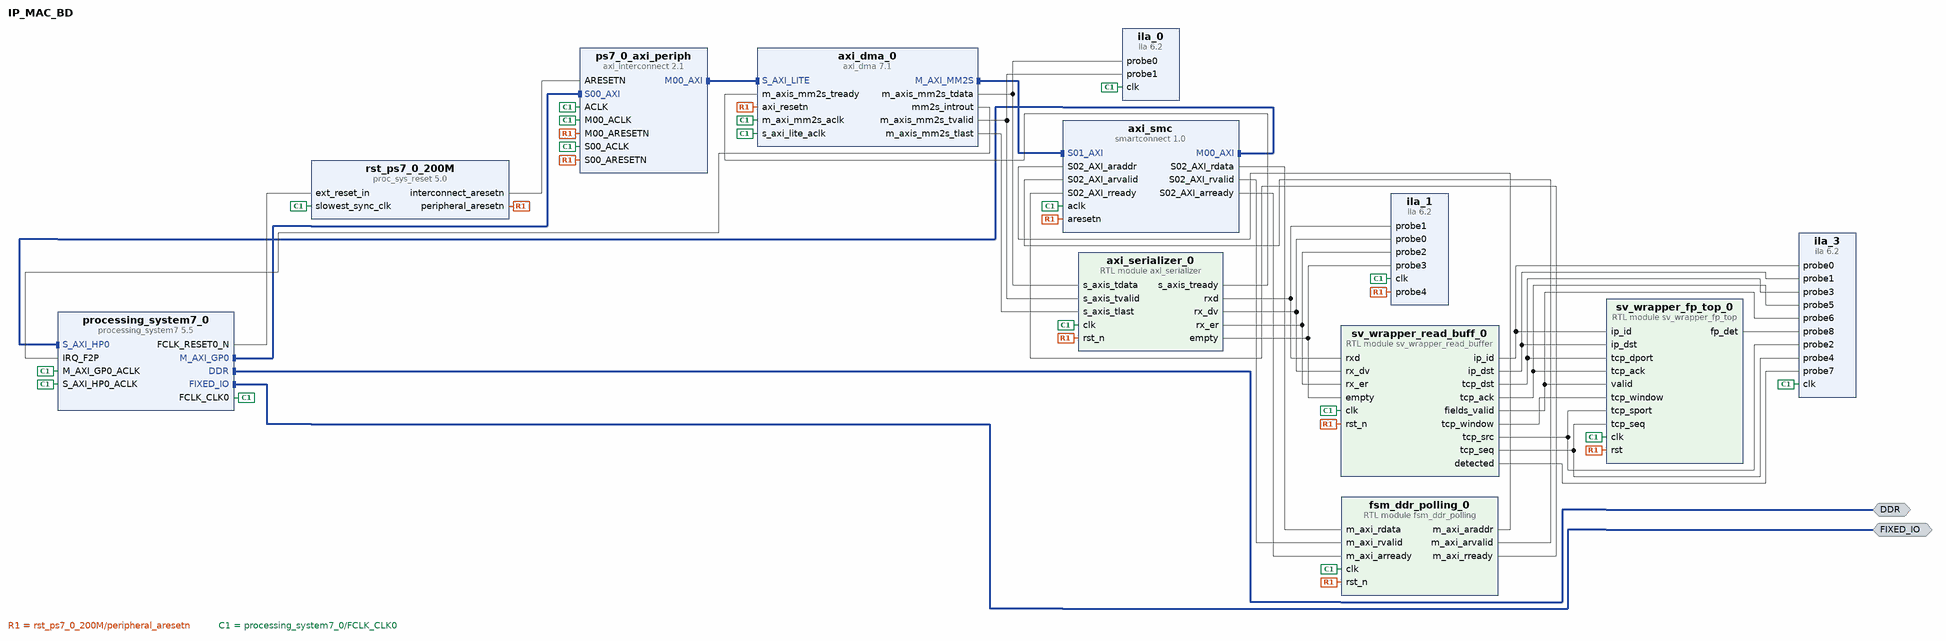
[diagram p0: block diagram of the top level]
# Vivado block design IP_MAC_BD, xc7z020clg484-1, Vivado 2020.2
create_bd_design IP_MAC_BD

create_bd_intf_port -mode Master -vlnv xilinx.com:interface:ddrx_rtl:1.0 DDR
create_bd_intf_port -mode Master -vlnv xilinx.com:display_processing_system7:fixedio_rtl:1.0 FIXED_IO

create_bd_cell -type ip -vlnv xilinx.com:ip:processing_system7:5.5 processing_system7_0
set_property -dict [list \
  CONFIG.PCW_APU_PERIPHERAL_FREQMHZ 666.666666 \
  CONFIG.PCW_CAN0_CAN0_IO {MIO 46 .. 47} \
  CONFIG.PCW_CAN0_PERIPHERAL_ENABLE 1 \
  CONFIG.PCW_CAN_PERIPHERAL_FREQMHZ 23.8095 \
  CONFIG.PCW_ENET0_ENET0_IO {MIO 16 .. 27} \
  CONFIG.PCW_ENET0_GRP_MDIO_ENABLE 1 \
  CONFIG.PCW_ENET0_GRP_MDIO_IO {MIO 52 .. 53} \
  CONFIG.PCW_ENET0_PERIPHERAL_ENABLE 1 \
  CONFIG.PCW_ENET0_PERIPHERAL_FREQMHZ {100 Mbps} \
  CONFIG.PCW_ENET0_RESET_ENABLE 1 \
  CONFIG.PCW_ENET0_RESET_IO {MIO 11} \
  CONFIG.PCW_ENET_RESET_ENABLE 1 \
  CONFIG.PCW_ENET_RESET_SELECT {Share reset pin} \
  CONFIG.PCW_FPGA0_PERIPHERAL_FREQMHZ 150 \
  CONFIG.PCW_GPIO_MIO_GPIO_ENABLE 1 \
  CONFIG.PCW_GPIO_MIO_GPIO_IO MIO \
  CONFIG.PCW_I2C0_GRP_INT_ENABLE 0 \
  CONFIG.PCW_I2C0_I2C0_IO {MIO 50 .. 51} \
  CONFIG.PCW_I2C0_PERIPHERAL_ENABLE 1 \
  CONFIG.PCW_I2C0_RESET_ENABLE 1 \
  CONFIG.PCW_I2C0_RESET_IO {MIO 13} \
  CONFIG.PCW_I2C_PERIPHERAL_FREQMHZ 111.111115 \
  CONFIG.PCW_I2C_RESET_ENABLE 1 \
  CONFIG.PCW_I2C_RESET_SELECT {Share reset pin} \
  CONFIG.PCW_IRQ_F2P_INTR 1 \
  CONFIG.PCW_PRESET_BANK0_VOLTAGE {LVCMOS 1.8V} \
  CONFIG.PCW_PRESET_BANK1_VOLTAGE {LVCMOS 1.8V} \
  CONFIG.PCW_QSPI_GRP_FBCLK_ENABLE 1 \
  CONFIG.PCW_QSPI_GRP_FBCLK_IO {MIO 8} \
  CONFIG.PCW_QSPI_GRP_SINGLE_SS_ENABLE 1 \
  CONFIG.PCW_QSPI_GRP_SINGLE_SS_IO {MIO 1 .. 6} \
  CONFIG.PCW_QSPI_PERIPHERAL_ENABLE 1 \
  CONFIG.PCW_QSPI_QSPI_IO {MIO 1 .. 6} \
  CONFIG.PCW_SD0_GRP_CD_ENABLE 1 \
  CONFIG.PCW_SD0_GRP_CD_IO {MIO 0} \
  CONFIG.PCW_SD0_GRP_WP_ENABLE 1 \
  CONFIG.PCW_SD0_GRP_WP_IO {MIO 15} \
  CONFIG.PCW_SD0_PERIPHERAL_ENABLE 1 \
  CONFIG.PCW_SD0_SD0_IO {MIO 40 .. 45} \
  CONFIG.PCW_SDIO_PERIPHERAL_FREQMHZ 50 \
  CONFIG.PCW_SINGLE_QSPI_DATA_MODE x4 \
  CONFIG.PCW_TTC0_PERIPHERAL_ENABLE 1 \
  CONFIG.PCW_TTC0_TTC0_IO EMIO \
  CONFIG.PCW_UART1_PERIPHERAL_ENABLE 1 \
  CONFIG.PCW_UART1_UART1_IO {MIO 48 .. 49} \
  CONFIG.PCW_UART_PERIPHERAL_FREQMHZ 50 \
  CONFIG.PCW_UIPARAM_DDR_FREQ_MHZ 533.333333 \
  CONFIG.PCW_UIPARAM_DDR_PARTNO {MT41J256M8 HX-15E} \
  CONFIG.PCW_USB0_PERIPHERAL_ENABLE 1 \
  CONFIG.PCW_USB0_RESET_ENABLE 1 \
  CONFIG.PCW_USB0_RESET_IO {MIO 7} \
  CONFIG.PCW_USB0_USB0_IO {MIO 28 .. 39} \
  CONFIG.PCW_USB_RESET_ENABLE 1 \
  CONFIG.PCW_USB_RESET_SELECT {Share reset pin} \
  CONFIG.PCW_USE_FABRIC_INTERRUPT 1 \
  CONFIG.PCW_USE_S_AXI_HP0 1 \
  CONFIG.preset ZC702 \
] [get_bd_cells processing_system7_0]
# 230 more settings of processing_system7_0 are not shown: defaults, MIO pin electricals, DDR timing, and values the tool derives
create_bd_cell -type module -reference sv_wrapper_fp_top sv_wrapper_fp_top_0
create_bd_cell -type ip -vlnv xilinx.com:ip:axi_dma:7.1 axi_dma_0
set_property -dict {CONFIG.c_include_mm2s 1 CONFIG.c_include_s2mm 0 CONFIG.c_include_sg 0} [get_bd_cells axi_dma_0]
create_bd_cell -type ip -vlnv xilinx.com:ip:smartconnect:1.0 axi_smc
set_property -dict {CONFIG.NUM_MI 1 CONFIG.NUM_SI 3} [get_bd_cells axi_smc]
create_bd_cell -type ip -vlnv xilinx.com:ip:ila:6.2 ila_0
set_property -dict [list \
  CONFIG.C_ENABLE_ILA_AXI_MON false \
  CONFIG.C_MONITOR_TYPE Native \
  CONFIG.C_NUM_OF_PROBES 2 \
  CONFIG.C_PROBE0_WIDTH 32 \
] [get_bd_cells ila_0]
create_bd_cell -type ip -vlnv xilinx.com:ip:ila:6.2 ila_1
set_property -dict [list \
  CONFIG.C_ENABLE_ILA_AXI_MON false \
  CONFIG.C_MONITOR_TYPE Native \
  CONFIG.C_NUM_OF_PROBES 5 \
  CONFIG.C_PROBE1_WIDTH 8 \
] [get_bd_cells ila_1]
create_bd_cell -type ip -vlnv xilinx.com:ip:axi_interconnect:2.1 ps7_0_axi_periph
set_property -dict {CONFIG.NUM_MI 1} [get_bd_cells ps7_0_axi_periph]
create_bd_cell -type ip -vlnv xilinx.com:ip:proc_sys_reset:5.0 rst_ps7_0_200M
create_bd_cell -type module -reference fsm_ddr_polling fsm_ddr_polling_0
create_bd_cell -type ip -vlnv xilinx.com:ip:ila:6.2 ila_3
set_property -dict [list \
  CONFIG.C_ENABLE_ILA_AXI_MON false \
  CONFIG.C_MONITOR_TYPE Native \
  CONFIG.C_NUM_OF_PROBES 9 \
  CONFIG.C_PROBE0_WIDTH 16 \
  CONFIG.C_PROBE1_WIDTH 32 \
  CONFIG.C_PROBE2_WIDTH 16 \
  CONFIG.C_PROBE3_WIDTH 16 \
  CONFIG.C_PROBE4_WIDTH 32 \
  CONFIG.C_PROBE5_WIDTH 32 \
  CONFIG.C_PROBE6_WIDTH 16 \
] [get_bd_cells ila_3]
create_bd_cell -type module -reference axi_serializer axi_serializer_0
create_bd_cell -type module -reference sv_wrapper_read_buffer sv_wrapper_read_buff_0

# ---- connections ----

connect_bd_intf_net [get_bd_intf_ports DDR] [get_bd_intf_pins processing_system7_0/DDR]
connect_bd_intf_net [get_bd_intf_ports FIXED_IO] [get_bd_intf_pins processing_system7_0/FIXED_IO]
connect_bd_intf_net [get_bd_intf_pins ps7_0_axi_periph/M00_AXI] [get_bd_intf_pins axi_dma_0/S_AXI_LITE]
connect_bd_intf_net [get_bd_intf_pins axi_smc/M00_AXI] [get_bd_intf_pins processing_system7_0/S_AXI_HP0]
connect_bd_intf_net [get_bd_intf_pins processing_system7_0/M_AXI_GP0] [get_bd_intf_pins ps7_0_axi_periph/S00_AXI]
connect_bd_intf_net [get_bd_intf_pins axi_dma_0/M_AXI_MM2S] [get_bd_intf_pins axi_smc/S01_AXI]
connect_bd_net [get_bd_pins processing_system7_0/FCLK_RESET0_N] [get_bd_pins rst_ps7_0_200M/ext_reset_in]
connect_bd_net [get_bd_pins rst_ps7_0_200M/peripheral_aresetn] \
  [get_bd_pins sv_wrapper_fp_top_0/rst] [get_bd_pins axi_dma_0/axi_resetn] [get_bd_pins axi_smc/aresetn] \
  [get_bd_pins ps7_0_axi_periph/S00_ARESETN] [get_bd_pins ps7_0_axi_periph/M00_ARESETN] [get_bd_pins fsm_ddr_polling_0/rst_n] \
  [get_bd_pins ila_1/probe4] [get_bd_pins axi_serializer_0/rst_n] [get_bd_pins sv_wrapper_read_buff_0/rst_n]
connect_bd_net [get_bd_pins rst_ps7_0_200M/interconnect_aresetn] [get_bd_pins ps7_0_axi_periph/ARESETN]
connect_bd_net [get_bd_pins processing_system7_0/FCLK_CLK0] \
  [get_bd_pins processing_system7_0/S_AXI_HP0_ACLK] [get_bd_pins processing_system7_0/M_AXI_GP0_ACLK] \
  [get_bd_pins sv_wrapper_fp_top_0/clk] [get_bd_pins axi_dma_0/s_axi_lite_aclk] [get_bd_pins axi_dma_0/m_axi_mm2s_aclk] \
  [get_bd_pins axi_smc/aclk] [get_bd_pins ila_0/clk] [get_bd_pins ila_1/clk] [get_bd_pins ps7_0_axi_periph/ACLK] \
  [get_bd_pins ps7_0_axi_periph/S00_ACLK] [get_bd_pins ps7_0_axi_periph/M00_ACLK] \
  [get_bd_pins rst_ps7_0_200M/slowest_sync_clk] [get_bd_pins fsm_ddr_polling_0/clk] [get_bd_pins ila_3/clk] \
  [get_bd_pins axi_serializer_0/clk] [get_bd_pins sv_wrapper_read_buff_0/clk]
connect_bd_net [get_bd_pins axi_dma_0/mm2s_introut] [get_bd_pins processing_system7_0/IRQ_F2P]
connect_bd_net [get_bd_pins axi_dma_0/m_axis_mm2s_tdata] [get_bd_pins ila_0/probe0] [get_bd_pins axi_serializer_0/s_axis_tdata]
connect_bd_net [get_bd_pins axi_dma_0/m_axis_mm2s_tlast] [get_bd_pins axi_serializer_0/s_axis_tlast]
connect_bd_net [get_bd_pins axi_serializer_0/s_axis_tready] [get_bd_pins axi_dma_0/m_axis_mm2s_tready]
connect_bd_net [get_bd_pins axi_dma_0/m_axis_mm2s_tvalid] [get_bd_pins ila_0/probe1] [get_bd_pins axi_serializer_0/s_axis_tvalid]
connect_bd_net [get_bd_pins axi_serializer_0/rxd] [get_bd_pins ila_1/probe1] [get_bd_pins sv_wrapper_read_buff_0/rxd]
connect_bd_net [get_bd_pins axi_serializer_0/rx_dv] [get_bd_pins ila_1/probe0] [get_bd_pins sv_wrapper_read_buff_0/rx_dv]
connect_bd_net [get_bd_pins axi_serializer_0/rx_er] [get_bd_pins ila_1/probe2] [get_bd_pins sv_wrapper_read_buff_0/rx_er]
connect_bd_net [get_bd_pins sv_wrapper_read_buff_0/ip_id] [get_bd_pins sv_wrapper_fp_top_0/ip_id] [get_bd_pins ila_3/probe0]
connect_bd_net [get_bd_pins sv_wrapper_read_buff_0/ip_dst] [get_bd_pins sv_wrapper_fp_top_0/ip_dst] [get_bd_pins ila_3/probe1]
connect_bd_net [get_bd_pins sv_wrapper_read_buff_0/tcp_dst] [get_bd_pins sv_wrapper_fp_top_0/tcp_dport] [get_bd_pins ila_3/probe3]
connect_bd_net [get_bd_pins sv_wrapper_read_buff_0/tcp_ack] [get_bd_pins sv_wrapper_fp_top_0/tcp_ack] [get_bd_pins ila_3/probe5]
connect_bd_net [get_bd_pins sv_wrapper_read_buff_0/tcp_window] [get_bd_pins sv_wrapper_fp_top_0/tcp_window]
connect_bd_net [get_bd_pins sv_wrapper_read_buff_0/fields_valid] [get_bd_pins sv_wrapper_fp_top_0/valid] [get_bd_pins ila_3/probe6]
connect_bd_net [get_bd_pins fsm_ddr_polling_0/m_axi_araddr] [get_bd_pins axi_smc/S02_AXI_araddr]
connect_bd_net [get_bd_pins fsm_ddr_polling_0/m_axi_arvalid] [get_bd_pins axi_smc/S02_AXI_arvalid]
connect_bd_net [get_bd_pins fsm_ddr_polling_0/m_axi_rready] [get_bd_pins axi_smc/S02_AXI_rready]
connect_bd_net [get_bd_pins axi_smc/S02_AXI_rdata] [get_bd_pins fsm_ddr_polling_0/m_axi_rdata]
connect_bd_net [get_bd_pins axi_smc/S02_AXI_rvalid] [get_bd_pins fsm_ddr_polling_0/m_axi_rvalid]
connect_bd_net [get_bd_pins axi_smc/S02_AXI_arready] [get_bd_pins fsm_ddr_polling_0/m_axi_arready]
connect_bd_net [get_bd_pins sv_wrapper_read_buff_0/tcp_src] [get_bd_pins sv_wrapper_fp_top_0/tcp_sport] [get_bd_pins ila_3/probe2]
connect_bd_net [get_bd_pins axi_serializer_0/empty] [get_bd_pins ila_1/probe3] [get_bd_pins sv_wrapper_read_buff_0/empty]
connect_bd_net [get_bd_pins sv_wrapper_read_buff_0/tcp_seq] [get_bd_pins ila_3/probe4] [get_bd_pins sv_wrapper_fp_top_0/tcp_seq]
connect_bd_net [get_bd_pins sv_wrapper_read_buff_0/detected] [get_bd_pins ila_3/probe7]
connect_bd_net [get_bd_pins sv_wrapper_fp_top_0/fp_det] [get_bd_pins ila_3/probe8]

# ---- address map ----
assign_bd_address -offset 0x00000000 -range 1G -target_address_space [get_bd_addr_spaces axi_dma_0/Data_MM2S] [get_bd_addr_segs processing_system7_0/S_AXI_HP0/HP0_DDR_LOWOCM]
assign_bd_address -offset 0x40400000 -range 64K -target_address_space [get_bd_addr_spaces processing_system7_0/Data] [get_bd_addr_segs axi_dma_0/S_AXI_LITE/Reg]

validate_bd_design
save_bd_design
